# EAGLE schematic Hx711_schematic_V1_r1.0 (EAGLE 9.6.2)
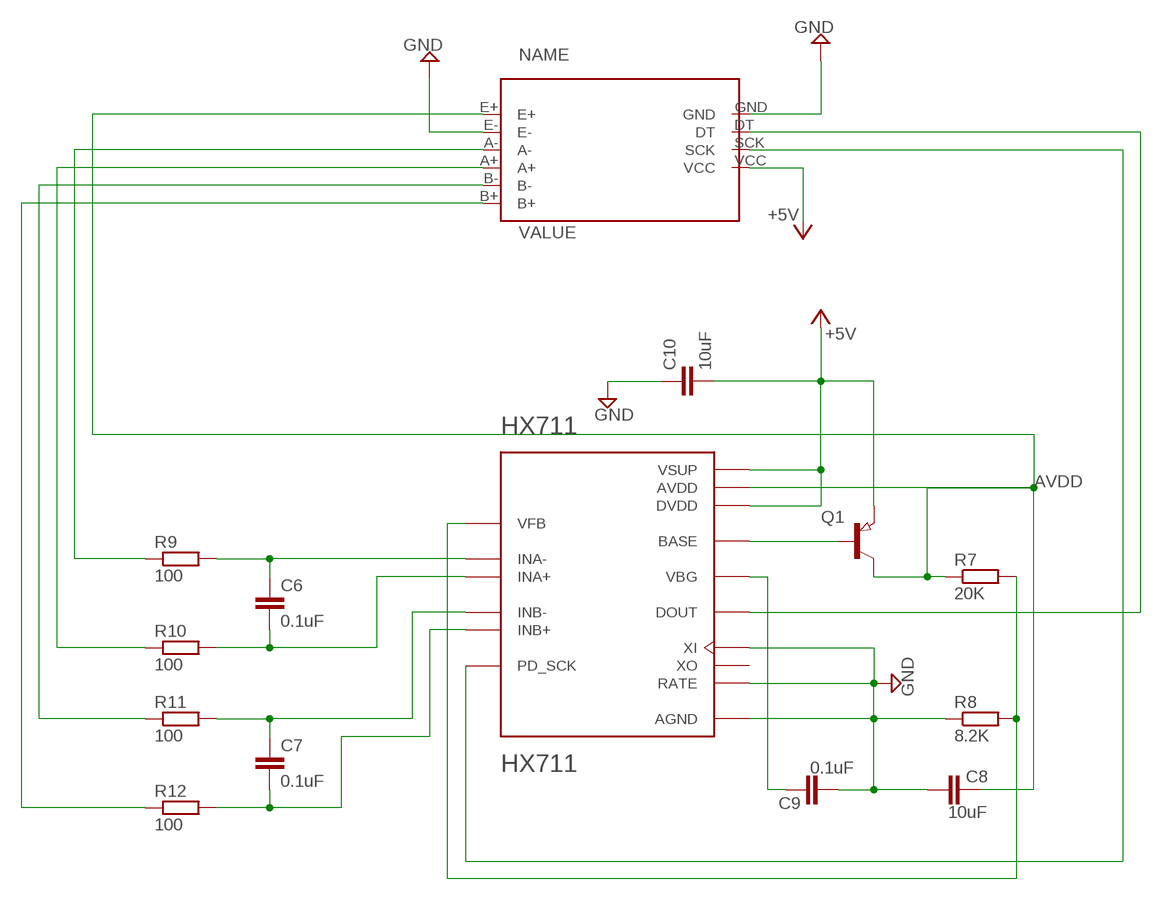
[diagram p0: schematic, sheet 1]

## Parts
C6  0.1uF  C2.5/2  [C2.5-2]
C7  0.1uF  C2.5/2  [C2.5-2]
C8  10uF  C2.5/2  [C2.5-2]
C9  0.1uF  C2.5/2  [C2.5-2]
C10  10uF  C2.5/2  [C2.5-2]
HX711  HX711  [SOP127P600X180-16N]
Q1  PNP-TRANSISTOR_SOT23  [SOT23]
R7  20K  R-EU_R0603  [R0603]
R8  8.2K  R-EU_R0603  [R0603]
R9  100  R-EU_R0603  [R0603]
R10  100  R-EU_R0603  [R0603]
R11  100  R-EU_R0603  [R0603]
R12  100  R-EU_R0603  [R0603]
U$1  HX711A  [HX711]

## Nets
+5V: C10.2 HX711.1(VSUP) HX711.16(DVDD) Q1.2(E) U$1.VCC
A+: R10.1 U$1.A+
A-: R9.1 U$1.A-
AVDD: C8.1 HX711.3(AVDD) Q1.3(C) R7.1 U$1.E+
B+: R12.1 U$1.B+
B-: R11.1 U$1.B-
DT: HX711.12(DOUT) U$1.DT
GND: C8.2 C9.2 C10.1 HX711.5(AGND) HX711.14(XI) HX711.15(RATE) R8.1 U$1.E- U$1.GND
N$1: HX711.2(BASE) Q1.1(B)
N$3: HX711.4(VFB) R7.2 R8.2
N$4: C6.1 HX711.7(INA-) R9.2
N$5: C6.2 HX711.8(INA+) R10.2
N$6: C7.1 HX711.9(INB-) R11.2
N$7: C7.2 HX711.10(INB+) R12.2
N$8: C9.1 HX711.6(VBG)
SCK: HX711.11(PD_SCK) U$1.SCK
Unconnected: HX711.13(XO)

## Library data of the parts
C6-C10 = capacitor-wima:C: CAPACITOR naming: grid - package width
HX711 = HX711ss:HX711: Check availability <https://pricing.snapeda.com/parts/HX711/AVIA%20SEMICONDUCTOR/view-part?ref=eda>; AVAILABILITY: Not in stock; DESCRIPTION: Precision 24-bit analog-to-digital converter (ADC) designed for weigh scales and industrial control applications to interface directly with a bridge sensor.; MF: AVIA SEMICONDUCTOR; MP: HX711; PACKAGE: None; PRICE: None
Q1 = semicon-smd-ipc:PNP-TRANSISTOR_: PNP TRANSISTOR
R7-R12 = rcl:R-EU_: RESISTOR, European symbol; SPICEPREFIX: R
U$1 = HX711:HX711